# Altium schematic sheet Switches_Leds.SchDoc
size A3; SheetNumber: 9; SheetTotal: 13
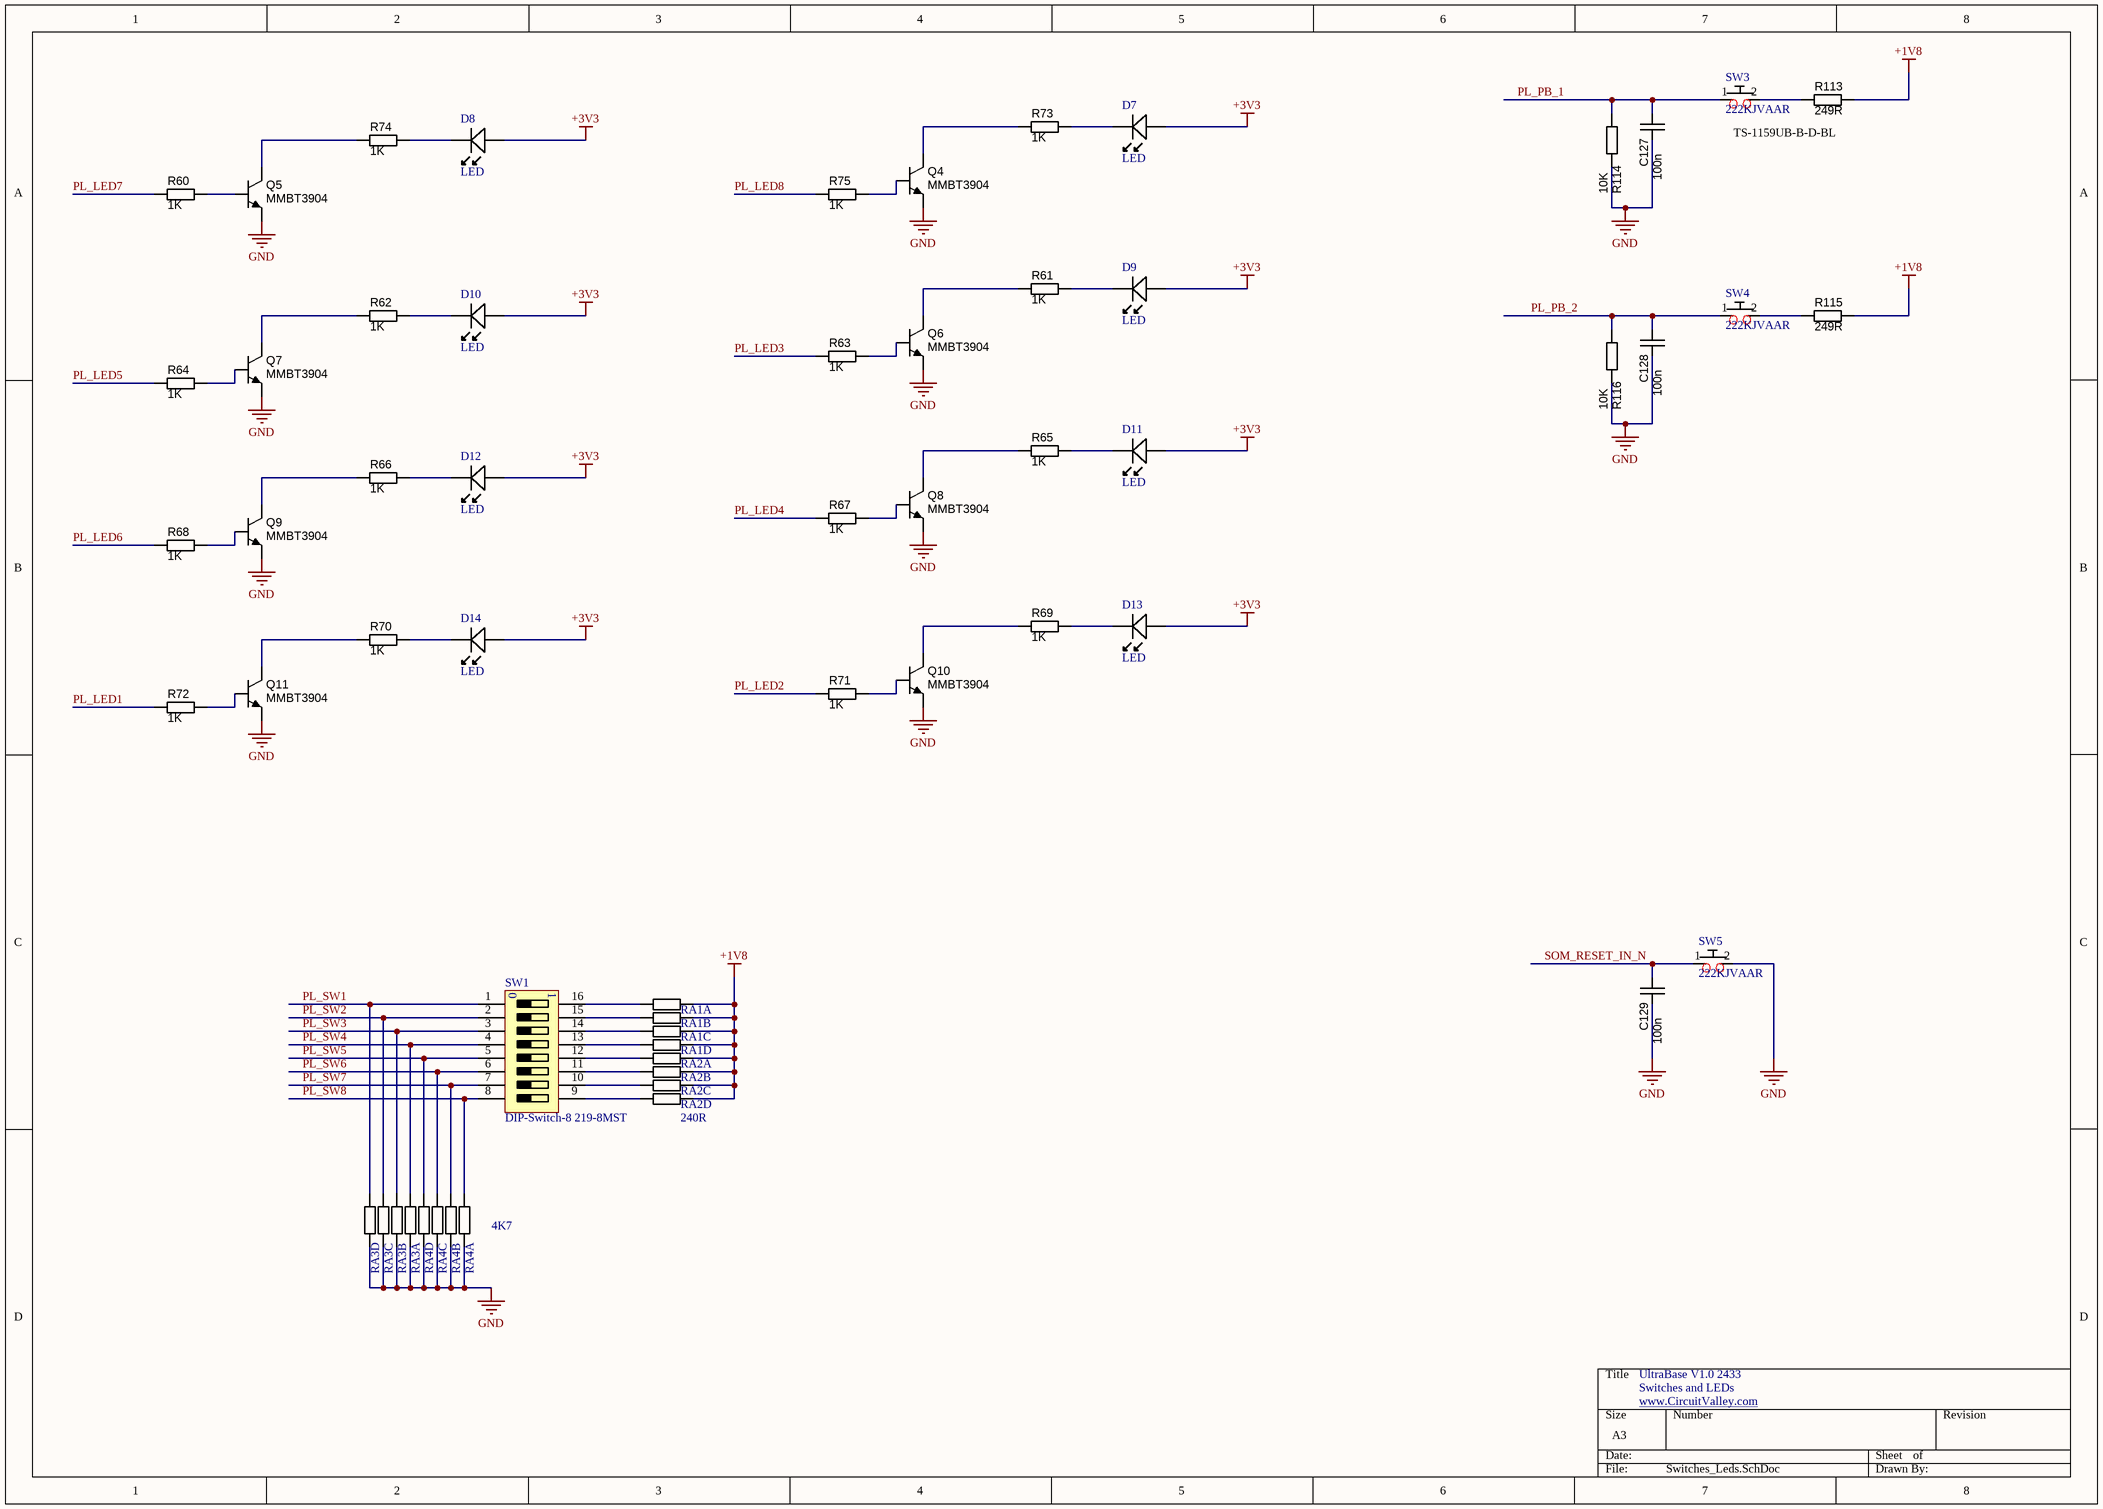
[diagram p0: Switches_Leds.SchDoc]

## Parts
C127  100n  [CAPC1608N]
C128  100n  [CAPC1608N]
C129  100n  [CAPC1608N]
D7  LED  [1206_LED]
D8  LED  [1206_LED]
D9  LED  [1206_LED]
D10  LED  [1206_LED]
D11  LED  [1206_LED]
D12  LED  [1206_LED]
D13  LED  [1206_LED]
D14  LED  [1206_LED]
Q4  Manufacturer Part Number 1: MMBT3904  [SOT23-3]  (hidden comment: NPN_MMBT3904)
Q5  Manufacturer Part Number 1: MMBT3904  [SOT23-3]  (hidden comment: NPN_MMBT3904)
Q6  Manufacturer Part Number 1: MMBT3904  [SOT23-3]  (hidden comment: NPN_MMBT3904)
Q7  Manufacturer Part Number 1: MMBT3904  [SOT23-3]  (hidden comment: NPN_MMBT3904)
Q8  Manufacturer Part Number 1: MMBT3904  [SOT23-3]  (hidden comment: NPN_MMBT3904)
Q9  Manufacturer Part Number 1: MMBT3904  [SOT23-3]  (hidden comment: NPN_MMBT3904)
Q10  Manufacturer Part Number 1: MMBT3904  [SOT23-3]  (hidden comment: NPN_MMBT3904)
Q11  Manufacturer Part Number 1: MMBT3904  [SOT23-3]  (hidden comment: NPN_MMBT3904)
R60  value 1K  [RESC1608N]  (hidden comment: RES_NL_0603)
R61  value 1K  [RESC1608N]  (hidden comment: RES_NL_0603)
R62  value 1K  [RESC1608N]  (hidden comment: RES_NL_0603)
R63  value 1K  [RESC1608N]  (hidden comment: RES_NL_0603)
R64  value 1K  [RESC1608N]  (hidden comment: RES_NL_0603)
R65  value 1K  [RESC1608N]  (hidden comment: RES_NL_0603)
R66  value 1K  [RESC1608N]  (hidden comment: RES_NL_0603)
R67  value 1K  [RESC1608N]  (hidden comment: RES_NL_0603)
R68  value 1K  [RESC1608N]  (hidden comment: RES_NL_0603)
R69  value 1K  [RESC1608N]  (hidden comment: RES_NL_0603)
R70  value 1K  [RESC1608N]  (hidden comment: RES_NL_0603)
R71  value 1K  [RESC1608N]  (hidden comment: RES_NL_0603)
R72  value 1K  [RESC1608N]  (hidden comment: RES_NL_0603)
R73  value 1K  [RESC1608N]  (hidden comment: RES_NL_0603)
R74  value 1K  [RESC1608N]  (hidden comment: RES_NL_0603)
R75  value 1K  [RESC1608N]  (hidden comment: RES_NL_0603)
R113  value 249R  [RESC1608N]  (hidden comment: RES_NL_0603)
R114  value 10K  [RESC1608N]  (hidden comment: RES_NL_0603)
R115  value 249R  [RESC1608N]  (hidden comment: RES_NL_0603)
R116  value 10K  [RESC1608N]  (hidden comment: RES_NL_0603)
RA1  Thick Film  [YC164]  (value not drawn)  (parts A,B,C,D of 4)
RA2  Thick Film  [YC164]  (value not drawn)  (parts A,B,C,D of 4)
RA3  Thick Film  [YC164]  (value not drawn)  (parts A,B,C,D of 4)
RA4  Thick Film  [YC164]  (value not drawn)  (parts A,B,C,D of 4)
SW1  DIP-Switch-8 219-8MST  [219-8MST]
SW3  222KJVAAR  [222KJVAAR]
SW4  222KJVAAR  [222KJVAAR]
SW5  222KJVAAR  [222KJVAAR]

## Nets
+1V8: R113.1 R115.1 RA1.1 RA1.2 RA1.3 RA1.4 RA2.1 RA2.2 RA2.3 RA2.4
+3V3: D7.A D8.A D9.A D10.A D11.A D12.A D13.A D14.A
GND: C127.2 C128.2 C129.2 Q4.2(E) Q5.2(E) Q6.2(E) Q7.2(E) Q8.2(E) Q9.2(E) Q10.2(E) Q11.2(E) R114.1 R116.1 RA3.1 RA3.2 RA3.3 RA3.4 RA4.1 RA4.2 RA4.3 RA4.4 SW5.2(P2)
PL_LED1: R72.1
PL_LED2: R71.1
PL_LED3: R63.1
PL_LED4: R67.1
PL_LED5: R64.1
PL_LED6: R68.1
PL_LED7: R60.1
PL_LED8: R75.1
PL_PB_1: C127.1 R114.2 SW3.1(P1)
PL_PB_2: C128.1 R116.2 SW4.1(P1)
PL_SW1: RA3.5 SW1.1
PL_SW2: RA3.6 SW1.2
PL_SW3: RA3.7 SW1.3
PL_SW4: RA3.8 SW1.4
PL_SW5: RA4.5 SW1.5
PL_SW6: RA4.6 SW1.6
PL_SW7: RA4.7 SW1.7
PL_SW8: RA4.8 SW1.8
SOM_RESET_IN_N: C129.1 SW5.1(P1)
NetD7_K: D7.K R73.2
NetD8_K: D8.K R74.2
NetD9_K: D9.K R61.2
NetD10_K: D10.K R62.2
NetD11_K: D11.K R65.2
NetD12_K: D12.K R66.2
NetD13_K: D13.K R69.2
NetD14_K: D14.K R70.2
NetQ4_1: Q4.1(B) R75.2
NetQ4_3: Q4.3(C) R73.1
NetQ5_1: Q5.1(B) R60.2
NetQ5_3: Q5.3(C) R74.1
NetQ6_1: Q6.1(B) R63.2
NetQ6_3: Q6.3(C) R61.1
NetQ7_1: Q7.1(B) R64.2
NetQ7_3: Q7.3(C) R62.1
NetQ8_1: Q8.1(B) R67.2
NetQ8_3: Q8.3(C) R65.1
NetQ9_1: Q9.1(B) R68.2
NetQ9_3: Q9.3(C) R66.1
NetQ10_1: Q10.1(B) R71.2
NetQ10_3: Q10.3(C) R69.1
NetQ11_1: Q11.1(B) R72.2
NetQ11_3: Q11.3(C) R70.1
NetR113_2: R113.2 SW3.2(P2)
NetR115_2: R115.2 SW4.2(P2)
NetRA1_5: RA1.5 SW1.13
NetRA1_6: RA1.6 SW1.14
NetRA1_7: RA1.7 SW1.15
NetRA1_8: RA1.8 SW1.16
NetRA2_5: RA2.5 SW1.9
NetRA2_6: RA2.6 SW1.10
NetRA2_7: RA2.7 SW1.11
NetRA2_8: RA2.8 SW1.12

## Notes on the sheet
- TS-1159UB-B-D-BL
- (near RA2) 240R
- (near RA4) 4K7
- UltraBase V1.0 2433
- Switches and LEDs
- www.CircuitValley.com <http://www.CircuitValley.com>
- (in symbol DIP-Switch-8) 0

## Library data of the parts
C127-C129 = CAPC_120p_0603_C0G_50V: Capacitor SMD Cer 120pF 10% 50V C0G 0603; Manufacturer 1: Kemet; Manufacturer Part Number 1: C0603C121K5GACTU; Ratings: 50V; C0G; Tolerance: ±10%; Operating Temperature: -55°C ~ 125°C; Package / Case: 0603 (1608 Metric); Supplier 1: Mouser; Supplier Part Number 1: 80-C0603C121K5G; Value: 100n
Q4-Q11 = NPN_MMBT3904: Transistor SMD NPN 40V 0.2A 350mW SOT-23; Manufacturer 1: Fairchild Semiconductor; Ratings: 40V; 200mA; 350mW; Material: Si; Package / Case: SOT-23; Supplier 1: Digi-Key; Supplier Part Number 1: MMBT3904FSCT-ND; Transistor Type: NPN; Mounting Type: Surface Mount
R60-R75 R113-R116 = RES_NL_0603: Resistor, SMD chip; Manufacturer 1: Royal Ohm; Ratings: 1/10 W; Tolerance: ±5%; Package / Case: 0603 (1608 metric)
RA1 = RES_ARRAY_0402_5%: Resistor array 4-pack 5% 0402 SMD; Value: 240R
RA2 RA3 = RES_ARRAY_0402_5%: Resistor array 4-pack 5% 0402 SMD
RA4 = RES_ARRAY_0402_5%: Resistor array 4-pack 5% 0402 SMD; Value: 4.7K
SW1 = DIP-Switch-8: DIP Switch 8 Position
SW3-SW5 = PushButton